# Altium schematic sheet Power.SchDoc
size A
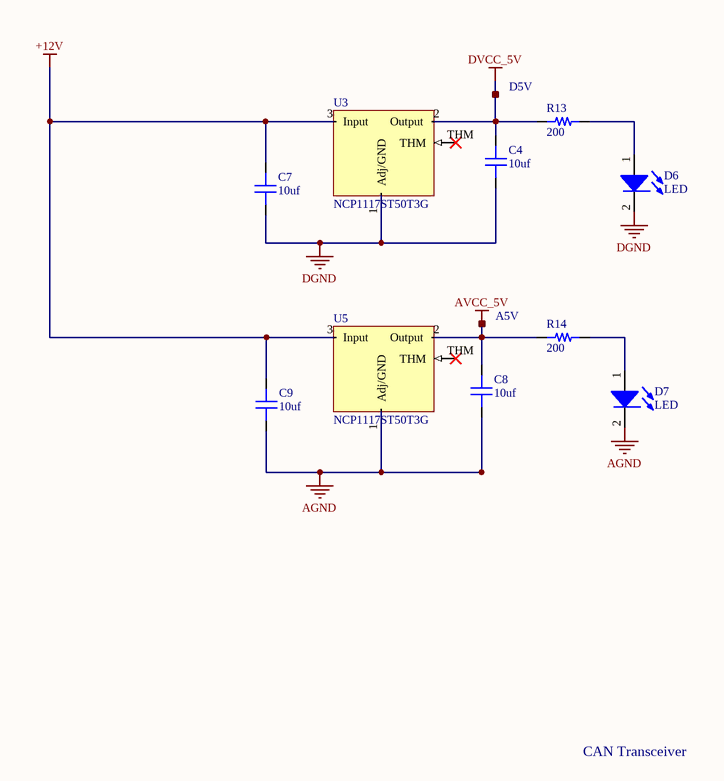
[diagram p0: Power.SchDoc]

## Parts
A5V  RCU-0C  [RCU-0C]  (value not drawn)
C4  value 10uf  [CAP 0603/1608]  (hidden comment: Capacitor MLCC 10uf 25V CAP 0603/1608)
C7  value 10uf  [CAP 0603/1608]  (hidden comment: Capacitor MLCC 10uf 25V CAP 0603/1608)
C8  value 10uf  [CAP 0603/1608]  (hidden comment: Capacitor MLCC 10uf 25V CAP 0603/1608)
C9  value 10uf  [CAP 0603/1608]  (hidden comment: Capacitor MLCC 10uf 25V CAP 0603/1608)
D5V  RCU-0C  [RCU-0C]  (value not drawn)
D6  LED  [0805_LED]
D7  LED  [0805_LED]
R13  value 200  [RES 0603/1608]  (hidden comment: Resistor 200 0603 1/10W 5%)
R14  value 200  [RES 0603/1608]  (hidden comment: Resistor 200 0603 1/10W 5%)
U3  NCP1117ST50T3G  [SOT-223-3]
U5  NCP1117ST50T3G  [SOT-223-3]

## Nets
+12V: C7.2 C9.2 U3.3(Input) U5.3(Input)
AGND: C8.1 C9.1 D7.2(K) U5.1(Adj/GND)
AVCC_5V: A5V.1 C8.2 R14.1 U5.2(Output)
DGND: C4.1 C7.1 D6.2(K) U3.1(Adj/GND)
DVCC_5V: C4.2 D5V.1 R13.1 U3.2(Output)
NetD6_1: D6.1(A) R13.2
NetD7_1: D7.1(A) R14.2

Not connected (* = marked no-connect by the designer): U3 THM*; U5 THM*

## Notes on the sheet
- CAN Transceiver

## Library data of the parts
A5V D5V = 5: Manufacturer_id: 1; idTable: 5; Name: RCU-0C_Test_Point; Drawer_id: 1; Package: 0603; MfrPartNo: RCU-0C; Link: https://www.digikey.com/product-detail/en/te-connectivity-amp-connectors/RCU-0C/A106145CT-ND/3477802; ComponentLink1Description: Datasheet; ComponentLink1URL: https://www.te.com/commerce/DocumentDelivery/DDEController?Action=srchrtrv&DocNm=1773266&DocType=DS&DocLang=English
C4 C7-C9 = 595: Manufacturer_id: 1; idCapacitor: 595; Name: Cap_10uf_25V_CAP 0603/1608; Dielectric: Ceramic; Created_By: Nick Mah; Drawer_id: 1; Voltage_Rating: 25V; Package: CAP 0603/1608; Created_Date: 10/20/2018
D6 = 1: idLED: 1; Name: LED_0805_RED; Value: Red; Vf: 0.7V; Manufacturer_id: 1; Drawer_id: 1; Package: 0805
D7 = 2: Manufacturer_id: 1; idLED: 2; Name: CMD17_0805_GREEN; Value: Green; Brightness: 7mcd; Id: 20mA; Vf: 2.1V; Drawer_id: 1; Package: 0805; Link: https://www.digikey.com/product-detail/en/visual-communications-company-vcc/CMD17-21VGD-TR8/L62505CT-ND/254936
R13 R14 = 1352: Manufacturer_id: 1; idResistor: 1352; Name: Res_200_0603_1/10W_5%; Created_By: Nick Mah; Supplier 1: Digi-Key; Drawer_id: 1; Tolerance: 5%; Power: 1/10W; Package: 0603; ComponentLink1Description: Datasheet; Created_Date: 2018-10-20
U3 U5 = 16: Linear Voltage Regulator IC Positive Fixed 1 Output 5V 1A SOT-223; Manufacturer_id: 1; idPMIC_Lin: 16; Name: 5V 1A LDO; Value: 5V 1.0A; Output_Config: 5V Fixed; Vin(Max): 20V; Vout(Min): 4.95; Vout(Max): 5.05; Dropout_Voltage: 1.2V @ 800mA; Created_By: Angel Delgado; Drawer_id: 1; Num_Outputs: 1; Vout_Type: Fixed; Current_Rating: 1A; Package: SOT-223-3; MfrPartNo: NCP1117ST50T3G; Link: https://www.digikey.com/product-detail/en/on-semiconductor/NCP1117ST50T3G/NCP1117ST50T3GOSCT-ND/1967217; ComponentLink1Description: Datasheet; ComponentLink1URL: https://www.onsemi.com/pub/Collateral/NCP1117-D.PDF